# EAGLE design AMS_TNN_V1.0 (EAGLE 9.6.2)
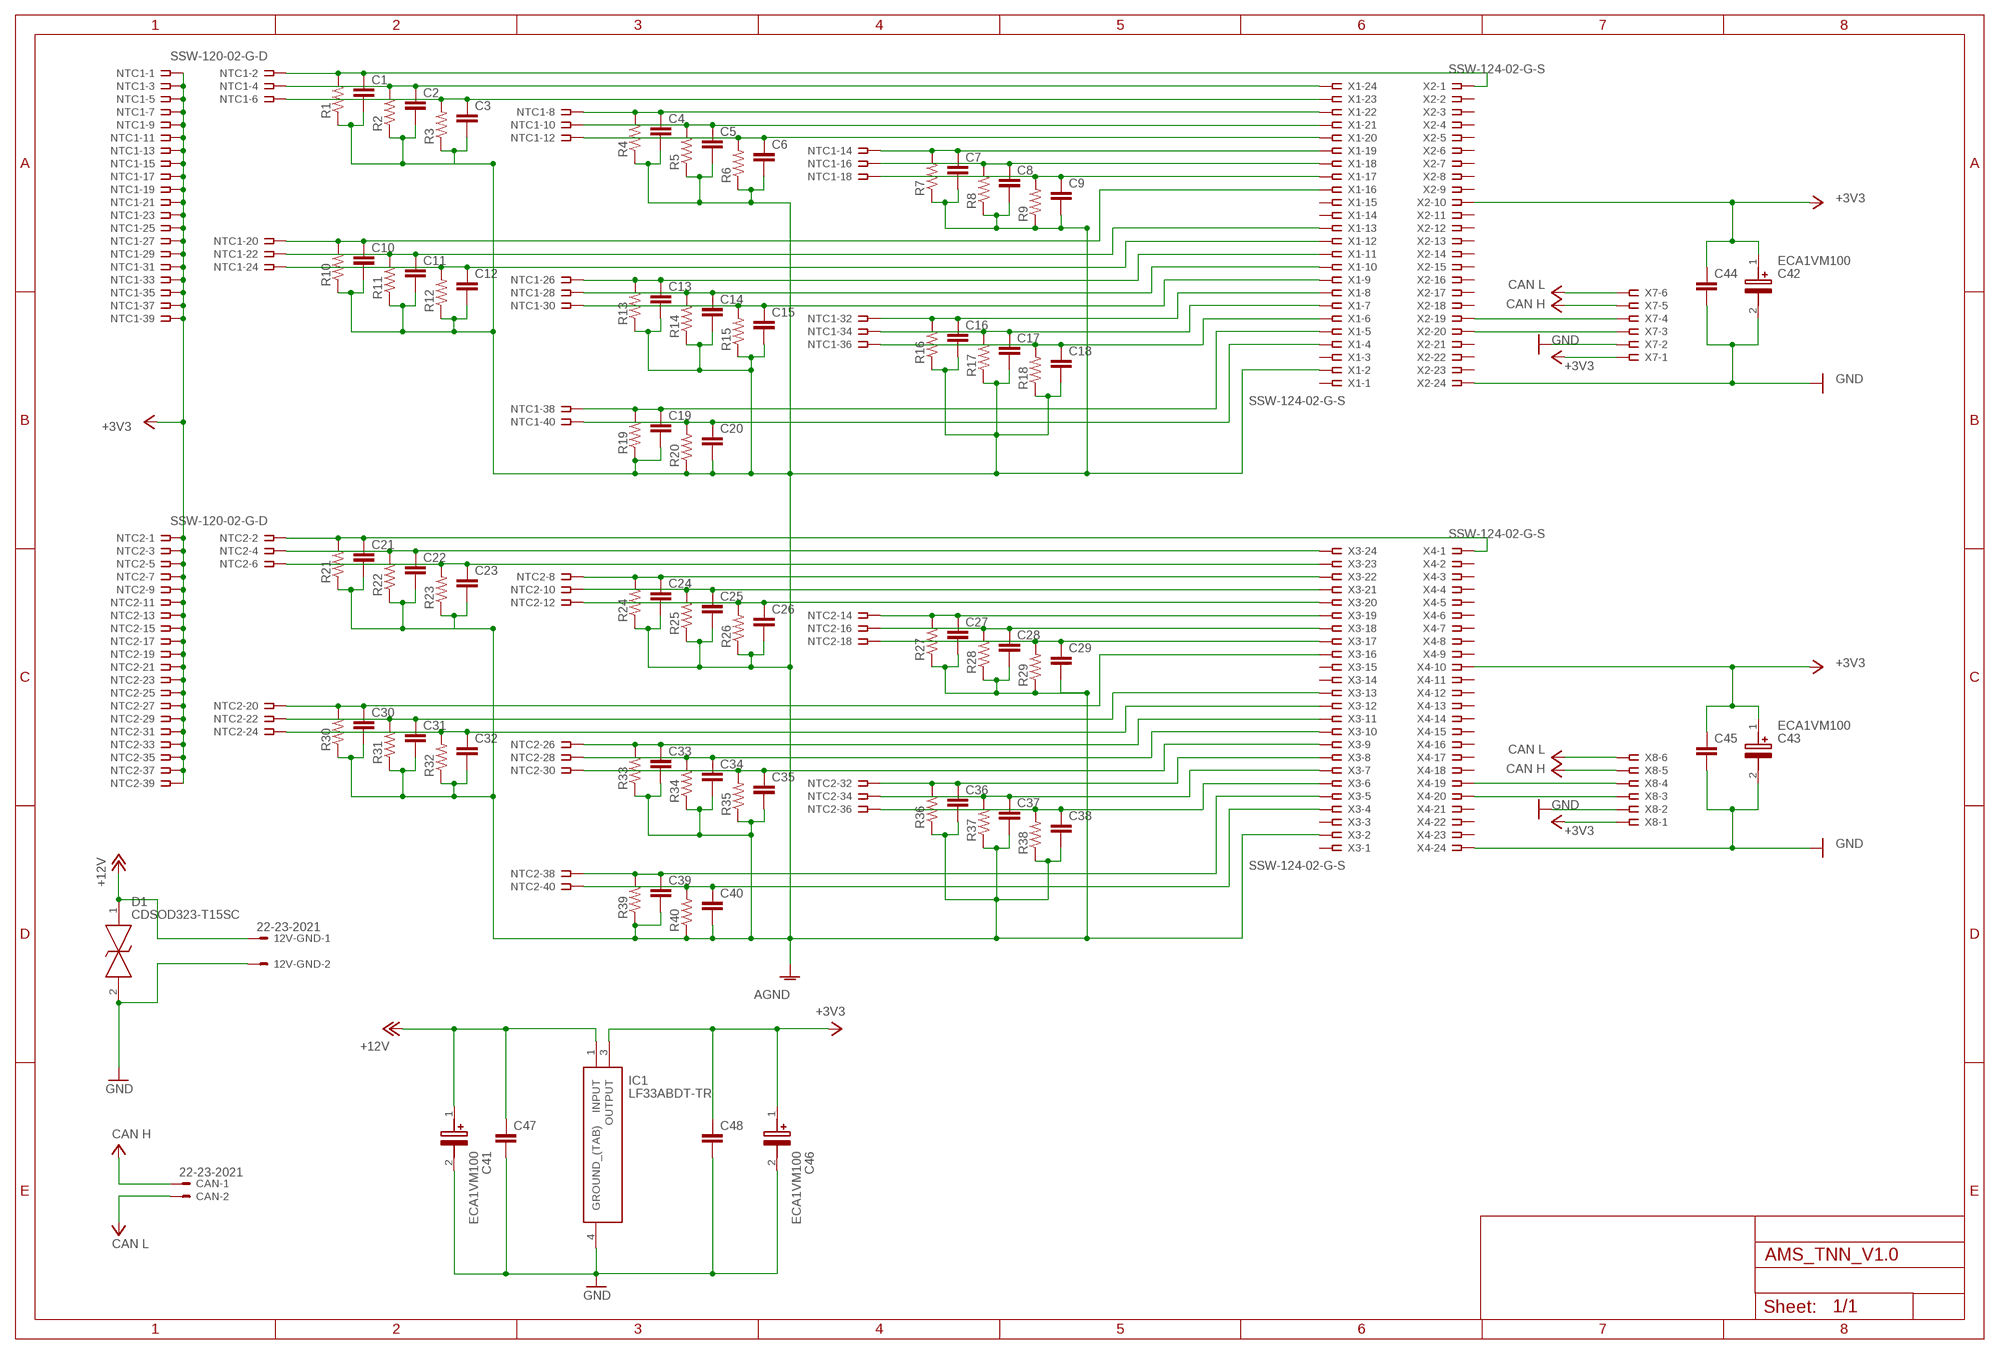
[diagram p0: schematic, sheet 1]

## Parts
12V-GND  22-23-2021  [22-23-2021]
C1  C-EUC0603  [C0603]
C2  C-EUC0603  [C0603]
C3  C-EUC0603  [C0603]
C4  C-EUC0603  [C0603]
C5  C-EUC0603  [C0603]
C6  C-EUC0603  [C0603]
C7  C-EUC0603  [C0603]
C8  C-EUC0603  [C0603]
C9  C-EUC0603  [C0603]
C10  C-EUC0603  [C0603]
C11  C-EUC0603  [C0603]
C12  C-EUC0603  [C0603]
C13  C-EUC0603  [C0603]
C14  C-EUC0603  [C0603]
C15  C-EUC0603  [C0603]
C16  C-EUC0603  [C0603]
C17  C-EUC0603  [C0603]
C18  C-EUC0603  [C0603]
C19  C-EUC0603  [C0603]
C20  C-EUC0603  [C0603]
C21  C-EUC0603  [C0603]
C22  C-EUC0603  [C0603]
C23  C-EUC0603  [C0603]
C24  C-EUC0603  [C0603]
C25  C-EUC0603  [C0603]
C26  C-EUC0603  [C0603]
C27  C-EUC0603  [C0603]
C28  C-EUC0603  [C0603]
C29  C-EUC0603  [C0603]
C30  C-EUC0603  [C0603]
C31  C-EUC0603  [C0603]
C32  C-EUC0603  [C0603]
C33  C-EUC0603  [C0603]
C34  C-EUC0603  [C0603]
C35  C-EUC0603  [C0603]
C36  C-EUC0603  [C0603]
C37  C-EUC0603  [C0603]
C38  C-EUC0603  [C0603]
C39  C-EUC0603  [C0603]
C40  C-EUC0603  [C0603]
C41  ECA1VM100  [CAPPRD200W55D525H1200]
C42  ECA1VM100  [CAPPRD200W55D525H1200]
C43  ECA1VM100  [CAPPRD200W55D525H1200]
C44  C-EUC0603  [C0603]
C45  C-EUC0603  [C0603]
C46  ECA1VM100  [CAPPRD200W55D525H1200]
C47  C-EUC0603  [C0603]
C48  C-EUC0603  [C0603]
CAN  22-23-2021  [22-23-2021]
D1  CDSOD323-T15SC  [SOD-323]
IC1  LF33ABDT-TR  [TO228P972X240-3N]
NTC1  SSW-120-02-G-D  [SSW-120-02-G-D]
NTC2  SSW-120-02-G-D  [SSW-120-02-G-D]
R1  R-US_R0603  [R0603]
R2  R-US_R0603  [R0603]
R3  R-US_R0603  [R0603]
R4  R-US_R0603  [R0603]
R5  R-US_R0603  [R0603]
R6  R-US_R0603  [R0603]
R7  R-US_R0603  [R0603]
R8  R-US_R0603  [R0603]
R9  R-US_R0603  [R0603]
R10  R-US_R0603  [R0603]
R11  R-US_R0603  [R0603]
R12  R-US_R0603  [R0603]
R13  R-US_R0603  [R0603]
R14  R-US_R0603  [R0603]
R15  R-US_R0603  [R0603]
R16  R-US_R0603  [R0603]
R17  R-US_R0603  [R0603]
R18  R-US_R0603  [R0603]
R19  R-US_R0603  [R0603]
R20  R-US_R0603  [R0603]
R21  R-US_R0603  [R0603]
R22  R-US_R0603  [R0603]
R23  R-US_R0603  [R0603]
R24  R-US_R0603  [R0603]
R25  R-US_R0603  [R0603]
R26  R-US_R0603  [R0603]
R27  R-US_R0603  [R0603]
R28  R-US_R0603  [R0603]
R29  R-US_R0603  [R0603]
R30  R-US_R0603  [R0603]
R31  R-US_R0603  [R0603]
R32  R-US_R0603  [R0603]
R33  R-US_R0603  [R0603]
R34  R-US_R0603  [R0603]
R35  R-US_R0603  [R0603]
R36  R-US_R0603  [R0603]
R37  R-US_R0603  [R0603]
R38  R-US_R0603  [R0603]
R39  R-US_R0603  [R0603]
R40  R-US_R0603  [R0603]
X1  SSW-124-02-G-S  [SSW-124-02-G-S]
X2  SSW-124-02-G-S  [SSW-124-02-G-S]
X3  SSW-124-02-G-S  [SSW-124-02-G-S]
X4  SSW-124-02-G-S  [SSW-124-02-G-S]
X7  SSW-106-02-G-S  [SSW-106-02-G-S]
X8  SSW-106-02-G-S  [SSW-106-02-G-S]

## Nets
+3V3: C42.1(+) C43.1(+) C44.1 C45.1 C46.1(+) C48.1 IC1.3(OUTPUT) NTC1.1 NTC1.3 NTC1.5 NTC1.7 NTC1.9 NTC1.11 NTC1.13 NTC1.15 NTC1.17 NTC1.19 NTC1.21 NTC1.23 NTC1.25 NTC1.27 NTC1.29 NTC1.31 NTC1.33 NTC1.35 NTC1.37 NTC1.39 NTC2.1 NTC2.3 NTC2.5 NTC2.7 NTC2.9 NTC2.11 NTC2.13 NTC2.15 NTC2.17 NTC2.19 NTC2.21 NTC2.23 NTC2.25 NTC2.27 NTC2.29 NTC2.31 NTC2.33 NTC2.35 NTC2.37 NTC2.39 X2.10 X4.10 X7.1 X8.1
+12V: 12V-GND.1 C41.1(+) C47.1 D1.1 IC1.1(INPUT)
AGND: C1.2 C2.2 C3.2 C4.2 C5.2 C6.2 C7.2 C8.2 C9.2 C10.2 C11.2 C12.2 C13.2 C14.2 C15.2 C16.2 C17.2 C18.2 C19.2 C20.2 C21.2 C22.2 C23.2 C24.2 C25.2 C26.2 C27.2 C28.2 C29.2 C30.2 C31.2 C32.2 C33.2 C34.2 C35.2 C36.2 C37.2 C38.2 C39.2 C40.2 R1.1 R2.1 R3.1 R4.1 R5.1 R6.1 R7.1 R8.1 R9.1 R10.1 R11.1 R12.1 R13.1 R14.1 R15.1 R16.1 R17.1 R18.1 R19.1 R20.1 R21.1 R22.1 R23.1 R24.1 R25.1 R26.1 R27.1 R28.1 R29.1 R30.1 R31.1 R32.1 R33.1 R34.1 R35.1 R36.1 R37.1 R38.1 R39.1 R40.1 X1.2 X3.2
GND: 12V-GND.2 C41.2(-) C42.2(-) C43.2(-) C44.2 C45.2 C46.2(-) C47.2 C48.2 D1.2 IC1.4(GROUND_(TAB)) X2.24 X4.24 X7.2 X8.2
N$1: C1.1 NTC1.2 R1.2 X2.1
N$2: C2.1 NTC1.4 R2.2 X1.24
N$3: C3.1 NTC1.6 R3.2 X1.23
N$4: C4.1 NTC1.8 R4.2 X1.22
N$5: C5.1 NTC1.10 R5.2 X1.21
N$6: C6.1 NTC1.12 R6.2 X1.20
N$7: C7.1 NTC1.14 R7.2 X1.19
N$8: C8.1 NTC1.16 R8.2 X1.18
N$9: C9.1 NTC1.18 R9.2 X1.17
N$10: C10.1 NTC1.20 R10.2 X1.16
N$11: C11.1 NTC1.22 R11.2 X1.13
N$12: C12.1 NTC1.24 R12.2 X1.12
N$13: C13.1 NTC1.26 R13.2 X1.11
N$14: C14.1 NTC1.28 R14.2 X1.10
N$15: C15.1 NTC1.30 R15.2 X1.9
N$16: C18.1 NTC1.36 R18.2 X1.6
N$17: C16.1 NTC1.32 R16.2 X1.8
N$18: C17.1 NTC1.34 R17.2 X1.7
N$19: C21.1 NTC2.2 R21.2 X4.1
N$20: C20.1 NTC1.40 R20.2 X1.4
N$21: C22.1 NTC2.4 R22.2 X3.24
N$22: C23.1 NTC2.6 R23.2 X3.23
N$23: C24.1 NTC2.8 R24.2 X3.22
N$24: C25.1 NTC2.10 R25.2 X3.21
N$25: C26.1 NTC2.12 R26.2 X3.20
N$26: C27.1 NTC2.14 R27.2 X3.19
N$27: C28.1 NTC2.16 R28.2 X3.18
N$28: C29.1 NTC2.18 R29.2 X3.17
N$29: C30.1 NTC2.20 R30.2 X3.16
N$30: C31.1 NTC2.22 R31.2 X3.13
N$31: C32.1 NTC2.24 R32.2 X3.12
N$32: C33.1 NTC2.26 R33.2 X3.11
N$33: C34.1 NTC2.28 R34.2 X3.10
N$34: C35.1 NTC2.30 R35.2 X3.9
N$35: C36.1 NTC2.32 R36.2 X3.8
N$36: C37.1 NTC2.34 R37.2 X3.7
N$37: C38.1 NTC2.36 R38.2 X3.6
N$38: C40.1 NTC2.40 R40.2 X3.4
N$39: C39.1 NTC2.38 R39.2 X3.5
N$40: X2.20 X7.3
N$41: X2.19 X7.4
N$42: X4.20 X8.3
N$43: X4.19 X8.4
N$46: C19.1 NTC1.38 R19.2 X1.5
V+: CAN.1 X7.5 X8.5 ; supply symbol labelled CAN H
V-: CAN.2 X7.6 X8.6 ; supply symbol labelled CAN L
Unconnected: X1.1 X1.3 X1.14 X1.15 X2.2 X2.3 X2.4 X2.5 X2.6 X2.7 X2.8 X2.9 X2.11 X2.12 X2.13 X2.14 X2.15 X2.16 X2.17 X2.18 X2.21 X2.22 X2.23 X3.1 X3.3 X3.14 X3.15 X4.2 X4.3 X4.4 X4.5 X4.6 X4.7 X4.8 X4.9 X4.11 X4.12 X4.13 X4.14 X4.15 X4.16 X4.17 X4.18 X4.21 X4.22 X4.23

## Library data of the parts
12V-GND CAN = con-molex:22-23-2021: .100" (2.54mm) Center Header - 2 Pin; MF: MOLEX; MPN: 22-23-2021; OC_FARNELL: 1462926; OC_NEWARK: 25C3832
C1-C40 C44 C45 C47 C48 = rcl:C-EU: CAPACITOR, European symbol; SPICEPREFIX: C
C41-C43 C46 = ECA1VM100:ECA1VM100: M radial Al elect cap,10uF 35V 85deg C Panasonic 10uF 35 V dc Aluminium Electrolytic Capacitor, M Series 2000h Source: Datasheet <http://industrial.panasonic.com/cdbs/www-data/pdf/RDF0000/ABA0000C1218.pdf>; DESCRIPTION: M radial Al elect cap,10uF 35V 85deg C Panasonic 10uF 35 V dc Aluminium Electrolytic Capacitor, M Series 2000h; HEIGHT: 12mm; MANUFACTURER_NAME: Panasonic; MANUFACTURER_PART_NUMBER: ECA1VM100
D1 = CDSOD323-T15SC:CDSOD323-T15SC: TVS Diode ESD 15V BiDirectional SOD323 Bourns CDSOD323-T15SC Bi-Directional TVS Diode, 400W peak, 2-Pin SOD-323 Source: Datasheet <https://datasheet.datasheetarchive.com/originals/distributors/Datasheets-DGA26/1841678.pdf>; ARROW_PART_NUMBER: CDSOD323-T15SC; ARROW_PRICE-STOCK: https://www.arrow.com/en/products/cdsod323-t15sc/bourns?region=nac; DESCRIPTION: TVS Diode ESD 15V BiDirectional SOD323 Bourns CDSOD323-T15SC Bi-Directional TVS Diode, 400W peak, 2-Pin SOD-323; HEIGHT: mm; MANUFACTURER_NAME: Bourns; MANUFACTURER_PART_NUMBER: CDSOD323-T15SC; MOUSER_PART_NUMBER: 652-CDSOD323-T15SC; MOUSER_PRICE-STOCK: https://www.mouser.co.uk/ProductDetail/Bourns/CDSOD323-T15SC?qs=6S5Watp5UnLvz%2FtnS7XuhA%3D%3D
IC1 = LF33ABDT-TR:LF33ABDT-TR: LF33ABDT-TR, Low Dropout Voltage Regulator, 0.5A, 3.3 V +/-1%, 3-Pin DPAK Source: Datasheet <http://www.st.com/web/en/resource/technical/document/datasheet/CD00000546.pdf>; ARROW_PART_NUMBER: LF33ABDT-TR; ARROW_PRICE-STOCK: https://www.arrow.com/en/products/lf33abdt-tr/stmicroelectronics?region=nac; DESCRIPTION: LF33ABDT-TR, Low Dropout Voltage Regulator, 0.5A, 3.3 V +/-1%, 3-Pin DPAK; HEIGHT: 2.4mm; MANUFACTURER_NAME: STMicroelectronics; MANUFACTURER_PART_NUMBER: LF33ABDT-TR; MOUSER_PART_NUMBER: 511-LF33ABDT-TR; MOUSER_PRICE-STOCK: https://www.mouser.co.uk/ProductDetail/STMicroelectronics/LF33ABDT-TR?qs=X0YN45AWjTaYMp6aKKXn6w%3D%3D
NTC1 NTC2 = con-samtec:SSW-120-02-G: THROUGH-HOLE .025" SQ POST SOCKET Source: Samtec SSW.pdf; MF: Samtec Inc.; MPN: SSW-120-02-G-D; OC_FARNELL: unknown; OC_NEWARK: 11P9639
R1-R40 = rcl:R-US_: RESISTOR, American symbol; SPICEPREFIX: R
X1-X4 = con-samtec:SSW-124-02-G-S: THROUGH-HOLE .025" SQ POST SOCKET Source: Samtec SSW.pdf; MF: Samtec Inc.; MPN: SSW-124-02-G-S; OC_FARNELL: unknown; OC_NEWARK: 11P9709
X7 X8 = con-samtec:SSW-106-02-G-S: THROUGH-HOLE .025" SQ POST SOCKET Source: Samtec SSW.pdf; MF: Samtec Inc.; MPN: SSW-106-02-G-S; OC_FARNELL: unknown; OC_NEWARK: 11P9416

## Board
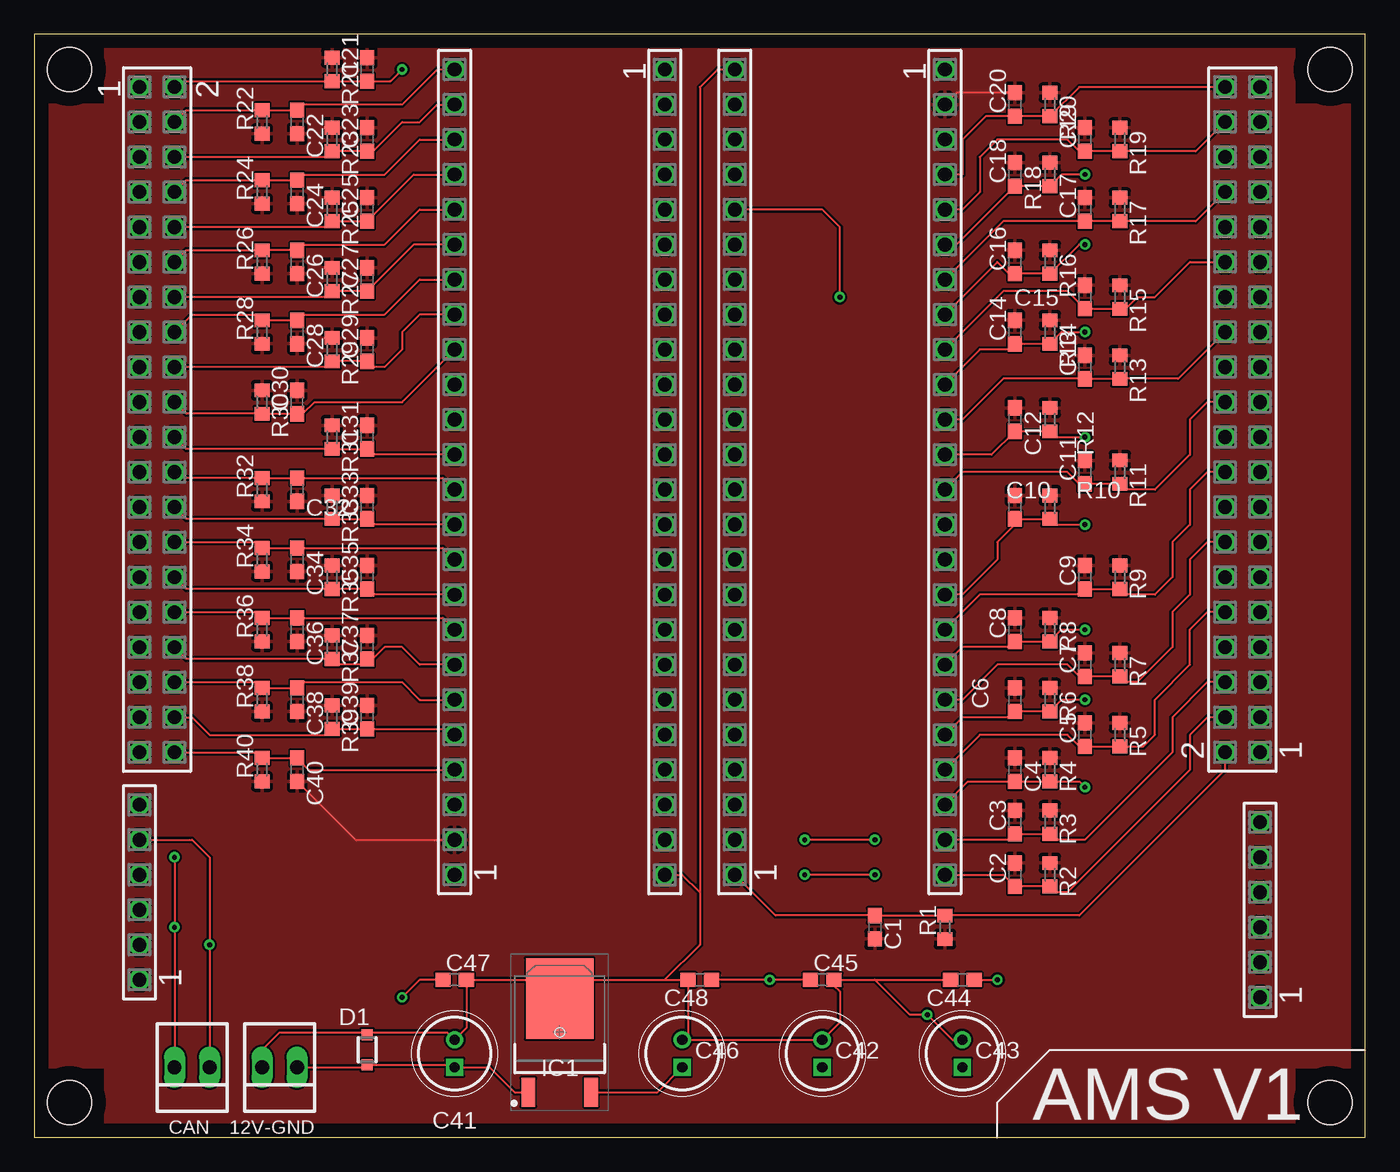
[diagram p1: board, top side]
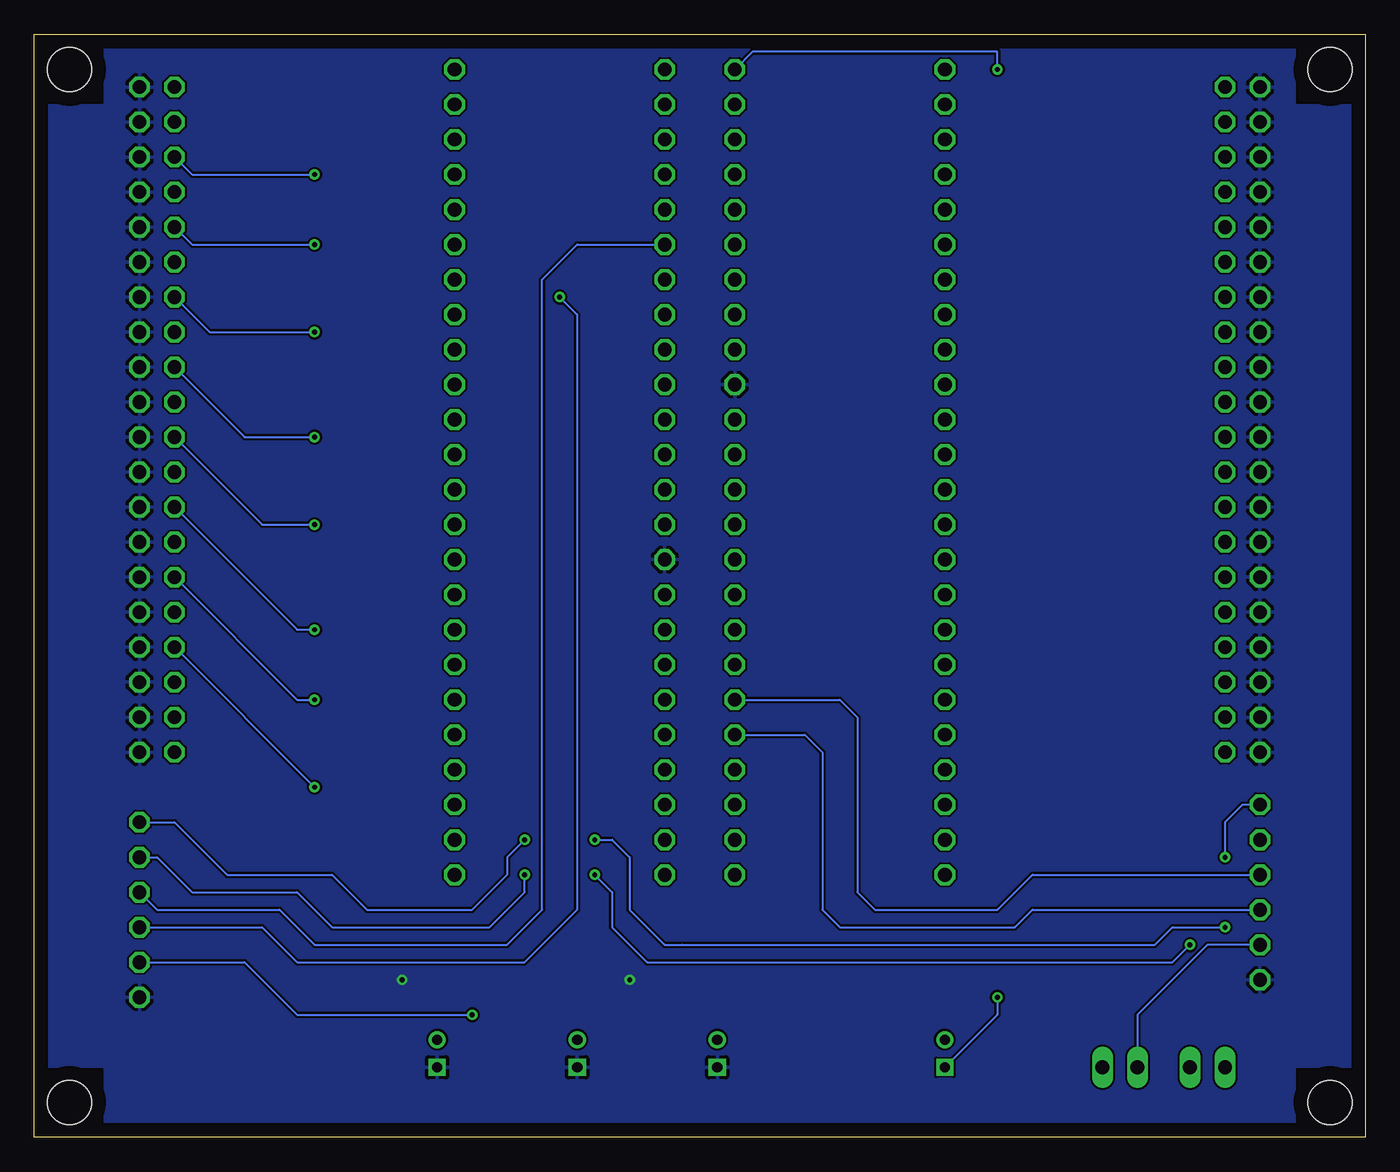
[diagram p2: board, bottom side, seen from below]

Size 96.52 x 80.01 mm. Coordinates in mm from the lower left corner, seen from the top.
Outline: 0,80.01 0,0 96.52,0 96.52,80.01 0,80.01
Copper layers (1*16): Top 0.035mm / dielectric 1.5mm / Bottom 0.035mm
Design rules "default": minimum track width 6mil, minimum drill 0.35mm, track to track 6mil, track to pad 6mil, pad to pad 6mil, via to via 6mil, smd to smd 6mil, copper to edge 40mil, drill to drill 6mil, minimum pad ring 10mil, minimum via ring 8mil, stop-mask expansion 4mil, vias tented up to drill 0mil, thermal gap 10mil
Holes 3.2 mm at 2.54,77.47 2.54,2.54 93.98,2.54 93.98,77.47

### Footprints (pad centres in the part's own frame; a part is rotated, then mirrored left to right if it is on the bottom)
22-23-2021 = drill 1 long: 1 -1.27,0; 2 1.27,0
C0603 = smd 1.1 x 1: 1 -0.85,0; 2 0.85,0
CAPPRD200W55D525H1200 = drill 0.75 pad 1.15 square: 1 0,0 | drill 0.75 pad 1.15: 2 2,0
SOD-323 = smd 0.8 x 0.8: 1 -1.1,0; 2 1.1,0
TO228P972X240-3N = smd 2.1 x 1: 1 -4.35,2.28; 3 -4.35,-2.28 | smd 5.85 x 4.9: 4 2.45,0
SSW-120-02-G-D = drill 1 pad 1.5 octagon: 1 -24.13,-1.27; 2 -24.13,1.27; 3 -21.59,-1.27; 4 -21.59,1.27; 5 -19.05,-1.27; 6 -19.05,1.27; 7 -16.51,-1.27; 8 -16.51,1.27; 9 -13.97,-1.27; 10 -13.97,1.27; 11 -11.43,-1.27; 12 -11.43,1.27; 13 -8.89,-1.27; 14 -8.89,1.27; 15 -6.35,-1.27; 16 -6.35,1.27; 17 -3.81,-1.27; 18 -3.81,1.27; 19 -1.27,-1.27; 20 -1.27,1.27; 21 1.27,-1.27; 22 1.27,1.27; 23 3.81,-1.27; 24 3.81,1.27; 25 6.35,-1.27; 26 6.35,1.27; 27 8.89,-1.27; 28 8.89,1.27; 29 11.43,-1.27; 30 11.43,1.27; 31 13.97,-1.27; 32 13.97,1.27; 33 16.51,-1.27; 34 16.51,1.27; 35 19.05,-1.27; 36 19.05,1.27; 37 21.59,-1.27; 38 21.59,1.27; 39 24.13,-1.27; 40 24.13,1.27
R0603 = smd 1 x 1.1: 1 -0.85,0; 2 0.85,0
SSW-124-02-G-S = drill 1 pad 1.5 octagon: 1 -29.21,0; 2 -26.67,0; 3 -24.13,0; 4 -21.59,0; 5 -19.05,0; 6 -16.51,0; 7 -13.97,0; 8 -11.43,0; 9 -8.89,0; 10 -6.35,0; 11 -3.81,0; 12 -1.27,0; 13 1.27,0; 14 3.81,0; 15 6.35,0; 16 8.89,0; 17 11.43,0; 18 13.97,0; 19 16.51,0; 20 19.05,0; 21 21.59,0; 22 24.13,0; 23 26.67,0; 24 29.21,0
SSW-106-02-G-S = drill 1 pad 1.5 octagon: 1 -6.35,0; 2 -3.81,0; 3 -1.27,0; 4 1.27,0; 5 3.81,0; 6 6.35,0

### Placement (x,y rotation side)
12V-GND  17.78,5.08 180 top
C1  60.96,15.24 270 top
C2  71.12,19.05 90 top
C3  71.12,22.86 90 top
C4  71.12,26.67 90 top
C5  76.2,29.21 90 top
C6  71.12,31.75 90 top
C7  76.2,34.29 90 top
C8  71.12,36.83 90 top
C9  76.2,40.64 90 top
C10  71.12,45.72 90 top
C11  76.2,48.26 90 top
C12  71.12,52.07 90 top
C13  76.2,55.88 90 top
C14  71.12,58.42 90 top
C15  76.2,60.96 90 top
C16  71.12,63.5 90 top
C17  76.2,67.31 90 top
C18  71.12,69.85 90 top
C19  76.2,72.39 90 top
C20  71.12,74.93 90 top
C21  24.13,77.47 90 top
C22  19.05,73.66 270 top
C23  24.13,72.39 90 top
C24  19.05,68.58 270 top
C25  24.13,67.31 90 top
C26  19.05,63.5 270 top
C27  24.13,62.23 90 top
C28  19.05,58.42 270 top
C29  24.13,57.15 90 top
C30  19.05,53.34 90 top
C31  24.13,50.8 90 top
C32  19.05,46.99 270 top
C33  24.13,45.72 90 top
C34  19.05,41.91 270 top
C35  24.13,40.64 90 top
C36  19.05,36.83 270 top
C37  24.13,35.56 90 top
C38  19.05,31.75 270 top
C39  24.13,30.48 90 top
C40  19.05,26.67 270 top
C41  30.48,5.08 90 top
C42  57.15,5.08 90 top
C43  67.31,5.08 90 top
C44  67.31,11.43 180 top
C45  57.15,11.43 0 top
C46  46.99,5.08 90 top
C47  30.48,11.43 0 top
C48  48.26,11.43 180 top
CAN  11.43,5.08 180 top
D1  24.13,6.35 90 top
IC1  38.1,7.62 90 top
NTC1  87.63,52.07 90 top
NTC2  8.89,52.07 270 top
R1  66.04,15.24 90 top
R2  73.66,19.05 270 top
R3  73.66,22.86 270 top
R4  73.66,26.67 270 top
R5  78.74,29.21 270 top
R6  73.66,31.75 270 top
R7  78.74,34.29 270 top
R8  73.66,36.83 270 top
R9  78.74,40.64 270 top
R10  73.66,45.72 270 top
R11  78.74,48.26 270 top
R12  73.66,52.07 270 top
R13  78.74,55.88 270 top
R14  73.66,58.42 270 top
R15  78.74,60.96 270 top
R16  73.66,63.5 270 top
R17  78.74,67.31 270 top
R18  73.66,69.85 270 top
R19  78.74,72.39 270 top
R20  73.66,74.93 270 top
R21  21.59,77.47 270 top
R22  16.51,73.66 90 top
R23  21.59,72.39 270 top
R24  16.51,68.58 90 top
R25  21.59,67.31 270 top
R26  16.51,63.5 90 top
R27  21.59,62.23 270 top
R28  16.51,58.42 90 top
R29  21.59,57.15 270 top
R30  16.51,53.34 270 top
R31  21.59,50.8 270 top
R32  16.51,46.99 90 top
R33  21.59,45.72 270 top
R34  16.51,41.91 90 top
R35  21.59,40.64 270 top
R36  16.51,36.83 90 top
R37  21.59,35.56 270 top
R38  16.51,31.75 90 top
R39  21.59,30.48 270 top
R40  16.51,26.67 90 top
X1  66.04,48.26 270 top
X2  50.8,48.26 90 top
X3  30.48,48.26 90 top
X4  45.72,48.26 270 top
X7  88.9,16.51 90 top
X8  7.62,17.78 90 top

### Tracks (layer width: path | path; a pad name or v marks a point on that pad's centre or on a via)
+3V3  (via drill 0.35)
  Top 0.152: C45.1 v53.34,11.43 C48.1 | C46.1 45.18,3.27 IC1.3 | C44.1 v69.85,11.43
  pour Bottom: 5.08,74.93 0,74.93 0,5.08 5.08,5.08 5.08,0 91.44,0 91.44,5.08 96.52,5.08 96.52,74.93 91.44,74.93 91.44,80.01 5.08,80.01
+12V  (via drill 0.35)
  Top 0.152: IC1.1 34.83,3.27 33.02,5.08 C41.1 30.31,5.25 D1.1 23.96,5.08 12V-GND.1 | C47.1 27.94,11.43 v26.67,10.16
  Bottom 0.152: v26.67,10.16 26.67,8.89 C41.1
AGND
  Top 0.152: C20.2 66.89,75.78 X1.2 | C40.2 23.28,21.59 X3.2
  pour Top: 0,74.93 0,5.08 5.08,5.08 5.08,0 91.44,0 91.44,5.08 96.52,5.08 96.52,74.93 91.44,74.93 91.44,80.01 5.08,80.01 5.08,74.93
GND  (via drill 0.35)
  Top 0.152: 45.72,11.43 39.46,11.43 IC1.4 38.1,10.16 36.83,11.43 C47.2 31.33,7.93 C41.2 29.94,7.62 24.3,7.62 D1.2 23.96,7.62 17.78,7.62 16.51,6.35 12V-GND.2 | 45.72,11.43 C48.2 47.41,7.5 C46.2 C42.2 58.42,8.35 58.42,10.58 58,11 C45.2 60.96,11.43 | 60.96,11.43 C44.2 | 60.96,11.43 63.5,8.89 v64.77,8.89 66.58,7.08 C43.2 | X2.24 49.53,77.47 48.26,76.2 48.26,17.78 | 48.26,17.78 48.26,13.97 45.72,11.43 | X4.24 46.99,19.05 48.26,17.78
  Bottom 0.152: X7.2 81.28,12.7 77.47,8.89 v64.77,8.89 | X8.2 11.43,13.97 16.51,8.89 12V-GND.2
N$1
  Top 0.152: X2.1 53.76,16.09 C1.1 R1.2 75.78,16.09 86.36,26.67 NTC1.2
N$2
  Top 0.152: X1.24 70.27,19.05 C2.1 R2.2 74.08,17.78 74.93,17.78 83.82,26.67 83.82,29.21 85.09,30.48 NTC1.4
N$3
  Top 0.152: X1.23 70.7,21.59 C3.1 R3.2 74.08,21.59 76.2,21.59 82.55,27.94 82.55,30.48 85.09,33.02 NTC1.6
N$4  (via drill 0.35)
  Top 0.152: X1.22 67.73,25.82 C4.1 R4.2 75.78,25.82 v76.2,25.4
  Bottom 0.152: NTC1.8 v76.2,25.4
N$5
  Top 0.152: NTC1.10 85.09,38.1 83.82,36.83 83.82,34.29 81.28,31.75 81.28,29.21 80.43,28.36 R5.2 C5.1 75.78,28.36 74.93,29.21 68.58,29.21 X1.21
N$6  (via drill 0.35)
  Top 0.152: v76.2,31.75 74.51,31.75 R6.2 C6.1 70.7,30.48 67.31,30.48 X1.20
  Bottom 0.152: NTC1.12 77.47,31.75 v76.2,31.75
N$7
  Top 0.152: NTC1.14 85.09,43.18 83.82,41.91 83.82,39.37 82.55,38.1 82.55,35.56 80.01,33.02 79.16,33.02 R7.2 C7.1 75.78,33.44 74.93,34.29 69.85,34.29 67.31,31.75 X1.19
N$8  (via drill 0.35)
  Top 0.152: v76.2,36.83 74.51,36.83 R8.2 C8.1 70.7,35.56 67.31,35.56 X1.18
  Bottom 0.152: NTC1.16 77.47,36.83 v76.2,36.83
N$9
  Top 0.152: NTC1.18 85.09,48.26 83.82,46.99 83.82,44.45 82.55,43.18 82.55,40.64 81.28,39.37 79.16,39.37 R9.2 C9.1 75.78,39.37 68.58,39.37 X1.17
N$10  (via drill 0.35)
  Top 0.152: v76.2,44.45 74.08,44.45 R10.2 C10.1 71.12,44.45 69.85,43.18 69.85,41.91 67.31,39.37 X1.16
  Bottom 0.152: NTC1.20 80.01,44.45 v76.2,44.45
N$11
  Top 0.152: NTC1.22 85.09,53.34 83.82,52.07 83.82,49.53 81.28,46.99 79.16,46.99 R11.2 C11.1 75.78,47.41 74.93,48.26 67.31,48.26 X1.13
N$12  (via drill 0.35)
  Top 0.152: v76.2,50.8 74.08,50.8 R12.2 C12.1 69.43,49.53 X1.12
  Bottom 0.152: NTC1.24 81.28,50.8 v76.2,50.8
N$13
  Top 0.152: NTC1.26 82.97,55.03 R13.2 C13.1 70.27,55.03 67.31,52.07 X1.11
N$14  (via drill 0.35)
  Top 0.152: v76.2,58.42 74.51,58.42 R14.2 C14.1 70.7,57.15 68.58,57.15 X1.10
  Bottom 0.152: NTC1.28 83.82,58.42 v76.2,58.42
N$15
  Top 0.152: X1.9 70.27,61.38 74.93,61.38 C15.1 R15.2 79.16,60.11 80.01,60.96 81.28,60.96 83.82,63.5 NTC1.30
N$16  (via drill 0.35)
  Top 0.152: v76.2,69.85 74.51,69.85 R18.2 C18.1 66.89,64.77 X1.6
  Bottom 0.152: NTC1.36 85.09,69.85 v76.2,69.85
N$17  (via drill 0.35)
  Top 0.152: v76.2,64.77 75.78,64.77 R16.2 C16.1 70.7,62.65 69.85,63.5 X1.8
  Bottom 0.152: NTC1.32 85.09,64.77 v76.2,64.77
N$18
  Top 0.152: NTC1.34 84.24,66.46 R17.2 C17.1 70.27,66.46 X1.7
N$19  (via drill 0.35)
  Top 0.152: NTC2.2 10.58,76.62 R21.2 C21.1 25.82,76.62 v26.67,77.47
  Bottom 0.152: X4.1 44.45,78.74 26.67,78.74 v26.67,77.47
N$20
  Top 0.152: NTC1.40 75.78,76.2 R20.2 C20.1 69,74.08 67.31,72.39 67.31,69.85 X1.4
N$21
  Top 0.152: NTC2.4 11.01,74.51 R22.2 C22.1 19.47,74.93 26.67,74.93 29.21,77.47 X3.24
N$22
  Top 0.152: NTC2.6 21.17,71.12 R23.2 C23.1 24.55,71.54 26.67,73.66 27.94,73.66 29.21,74.93 X3.23
N$23
  Top 0.152: NTC2.8 11.01,69.43 R24.2 C24.1 19.47,69.85 25.4,69.85 27.94,72.39 X3.22
N$24
  Top 0.152: NTC2.10 21.17,66.04 R25.2 C25.1 27.52,69.85 X3.21
N$25
  Top 0.152: NTC2.12 11.01,64.35 R26.2 C26.1 19.47,64.77 25.4,64.77 27.94,67.31 X3.20
N$26
  Top 0.152: X3.19 27.52,64.77 C27.1 R27.2 21.17,60.96 NTC2.14
N$27
  Top 0.152: NTC2.16 11.43,59.69 16.51,59.69 R28.2 C28.1 19.47,59.69 25.4,59.69 27.94,62.23 X3.18
N$28
  Top 0.152: X3.17 27.94,59.69 26.67,58.42 26.67,57.15 25.4,55.88 24.55,55.88 C29.1 R29.2 21.17,55.88 NTC2.18
N$29
  Top 0.152: NTC2.20 11.01,52.49 R30.2 C30.1 19.47,52.49 20.32,53.34 26.67,53.34 X3.16
N$30
  Top 0.152: X3.13 24.55,49.53 C31.1 R31.2 11.01,49.95 NTC2.22
N$31
  Top 0.152: NTC2.24 10.58,47.84 R32.2 C32.1 29.63,47.84 X3.12
N$32
  Top 0.152: X3.11 24.55,44.45 C33.1 R33.2 11.01,44.87 NTC2.26
N$33
  Top 0.152: NTC2.28 16.09,43.18 R34.2 18.63,42.76 19.05,43.18 C34.1 29.63,42.76 X3.10
N$34
  Top 0.152: X3.9 24.55,39.37 C35.1 R35.2 11.01,39.79 NTC2.30
N$35
  Top 0.152: NTC2.32 16.51,38.1 R36.2 C36.1 29.63,37.68 X3.8
N$36
  Top 0.152: X3.7 27.94,34.29 26.67,35.56 25.4,35.56 24.13,34.29 C37.1 23.71,34.29 21.59,34.29 R37.2 11.01,34.71 NTC2.34
N$37
  Top 0.152: NTC2.36 16.51,33.02 R38.2 C38.1 19.47,33.02 26.67,33.02 27.94,31.75 X3.6
N$38
  Top 0.152: NTC2.40 16.51,27.94 R40.2 C40.1 19.9,26.67 X3.4
N$39
  Top 0.152: NTC2.38 11.43,30.48 12.7,29.21 21.59,29.21 R39.2 C39.1 30.06,29.63 X3.5
N$40  (via drill 0.35)
  Top 0.152: v58.42,60.96 58.42,66.04 57.15,67.31 X2.20
  Bottom 0.152: X7.3 80.01,15.24 77.47,12.7 60.96,12.7 57.15,16.51 57.15,59.69 v58.42,60.96
N$41
  Bottom 0.152: X7.4 87.63,16.51 78.74,16.51 76.2,13.97 62.23,13.97 59.69,16.51 59.69,62.23 57.15,64.77 X2.19
N$42
  Bottom 0.152: X4.20 40.64,29.21 39.37,27.94 39.37,16.51 38.1,15.24 25.4,15.24 24.13,16.51 X8.3
N$43
  Bottom 0.152: X4.19 38.1,31.75 36.83,30.48 36.83,17.78 35.56,16.51 26.67,16.51 24.13,19.05 X8.4
N$46
  Top 0.152: NTC1.38 84.24,71.54 R19.2 C19.1 75.78,71.54 74.93,72.39 69.85,72.39 68.58,71.12 68.58,68.58 67.31,67.31 X1.5
V+  (via drill 0.35)
  Top 0.152: X8.5 11.43,21.59 12.7,20.32 v12.7,13.97 CAN.1 | v60.96,19.05 v55.88,19.05
  Bottom 0.152: X7.5 87.63,20.32 85.09,17.78 77.47,17.78 74.93,15.24 63.5,15.24 60.96,17.78 v60.96,19.05 | v55.88,19.05 54.61,17.78 54.61,15.24 52.07,12.7 13.97,12.7 v12.7,13.97
V-  (via drill 0.35)
  Top 0.152: v10.16,20.32 v10.16,15.24 CAN.2 | v60.96,21.59 v55.88,21.59
  Bottom 0.152: X8.6 8.89,24.13 10.16,22.86 v10.16,20.32 | X7.6 86.36,22.86 82.55,19.05 74.93,19.05 72.39,16.51 64.77,16.51 62.23,19.05 62.23,20.32 v60.96,21.59 | v55.88,21.59 54.61,21.59 53.34,20.32 53.34,16.51 50.8,13.97 49.53,13.97 15.24,13.97 13.97,15.24 v10.16,15.24

### Text on the board
tNames: AMS V1